# Altium schematic sheet 5_Analog.SchDoc
size A3; DocumentNumber: 6; SheetNumber: 6; SheetTotal: 6
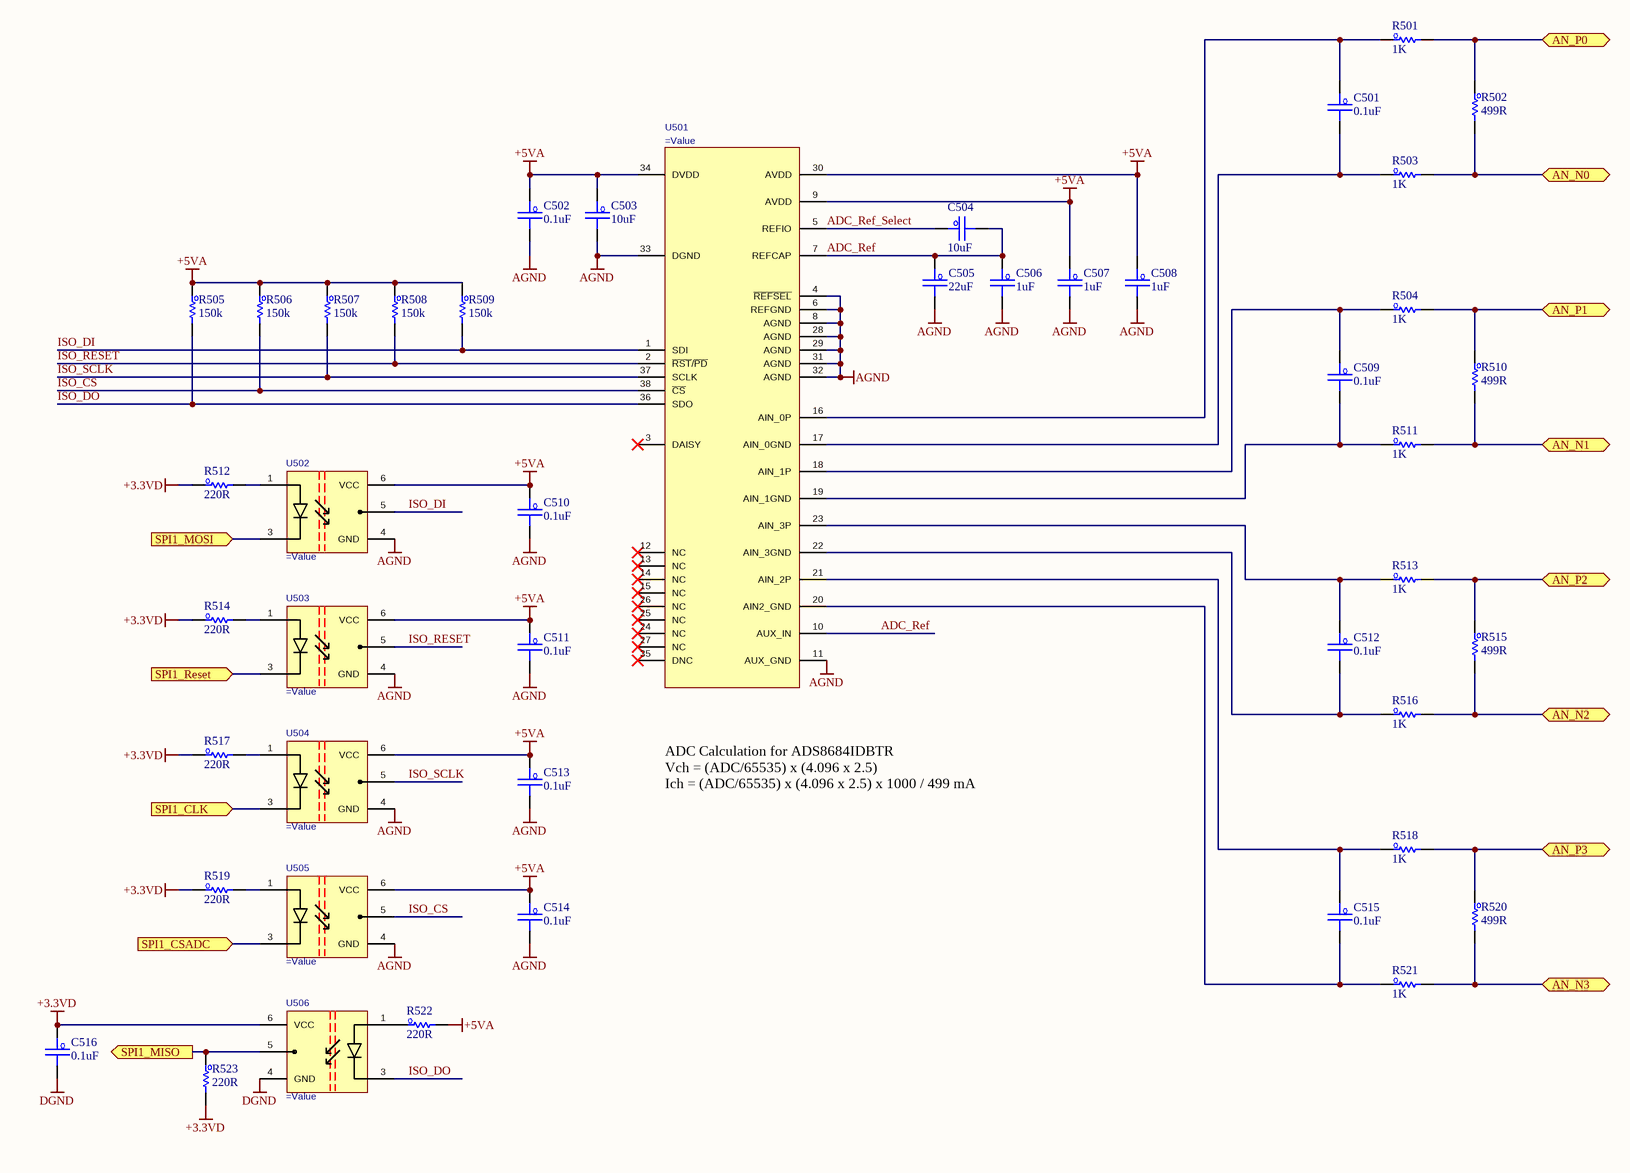
[diagram p0: 5_Analog.SchDoc]

## Parts
C501  0.1uF  [C_0603]
C502  0.1uF  [C_0603]
C503  10uF  [C_0603]
C504  10uF  [C_0603]
C505  22uF  [C_0603]
C506  1uF  [C_0603]
C507  1uF  [C_0603]
C508  1uF  [C_0603]
C509  0.1uF  [C_0603]
C510  0.1uF  [C_0603]
C511  0.1uF  [C_0603]
C512  0.1uF  [C_0603]
C513  0.1uF  [C_0603]
C514  0.1uF  [C_0603]
C515  0.1uF  [C_0603]
C516  0.1uF  [C_0603]
R501  1K  [R_0603]
R502  499R  [R_0603]
R503  1K  [R_0603]
R504  1K  [R_0603]
R505  150k  [R_0603]
R506  150k  [R_0603]
R507  150k  [R_0603]
R508  150k  [R_0603]
R509  150k  [R_0603]
R510  499R  [R_0603]
R511  1K  [R_0603]
R512  220R  [R_0603]
R513  1K  [R_0603]
R514  220R  [R_0603]
R515  499R  [R_0603]
R516  1K  [R_0603]
R517  220R  [R_0603]
R518  1K  [R_0603]
R519  220R  [R_0603]
R520  499R  [R_0603]
R521  1K  [R_0603]
R522  220R  [R_0603]
R523  220R  [R_0603]
U501  (no value)  [DBT0038A_N_TEX]
U502  (no value)  [5PIN SO6_TOS]
U503  (no value)  [5PIN SO6_TOS]
U504  (no value)  [5PIN SO6_TOS]
U505  (no value)  [5PIN SO6_TOS]
U506  (no value)  [5PIN SO6_TOS]

## Ports
AN_N0 (bidir), AN_N1 (bidir), AN_N2 (bidir), AN_N3 (bidir), AN_P0 (bidir), AN_P1 (bidir), AN_P2 (bidir), AN_P3 (bidir), SPI1_CLK (in), SPI1_CSADC (in), SPI1_MISO (out), SPI1_MOSI (in), SPI1_Reset (in)

## Nets
+3.3VD: C516.1 R512.1 R514.1 R517.1 R519.1 R523.2 U506.6(VCC)
+5VA: C502.1 C503.1 C507.1 C508.1 C510.1 C511.1 C513.1 C514.1 R505.1 R506.1 R507.1 R508.1 R509.1 R522.2 U501.9(AVDD) U501.30(AVDD) U501.34(DVDD) U502.6(VCC) U503.6(VCC) U504.6(VCC) U505.6(VCC)
AGND: C502.2 C503.2 C505.2 C506.2 C507.2 C508.2 C510.2 C511.2 C513.2 C514.2 U501.4(~{REFSEL}) U501.6(REFGND) U501.8(AGND) U501.11(AUX_GND) U501.28(AGND) U501.29(AGND) U501.31(AGND) U501.32(AGND) U501.33(DGND) U502.4(GND) U503.4(GND) U504.4(GND) U505.4(GND)
DGND: C516.2 U506.4(GND)
ADC_Ref: C504.2 C505.1 C506.1 U501.7(REFCAP) U501.10(AUX_IN)
ADC_Ref_Select: C504.1 U501.5(REFIO)
AN_N0: R502.2 R503.2 ; port AN_N0
AN_N1: R510.2 R511.2 ; port AN_N1
AN_N2: R515.2 R516.2 ; port AN_N2
AN_N3: R520.2 R521.2 ; port AN_N3
AN_P0: R501.2 R502.1 ; port AN_P0
AN_P1: R504.2 R510.1 ; port AN_P1
AN_P2: R513.2 R515.1 ; port AN_P2
AN_P3: R518.2 R520.1 ; port AN_P3
ISO_CS: R506.2 U501.38(~{CS}) U505.5(O1)
ISO_DI: R509.2 U501.1(SDI) U502.5(O1)
ISO_DO: R505.2 U501.36(SDO) U506.3(A)
ISO_RESET: R508.2 U501.2(~{RST}/~{PD}) U503.5(O1)
ISO_SCLK: R507.2 U501.37(SCLK) U504.5(O1)
SPI1_CLK: U504.3(A) ; port SPI1_CLK
SPI1_CSADC: U505.3(A) ; port SPI1_CSADC
SPI1_MISO: R523.1 U506.5(O1) ; port SPI1_MISO
SPI1_MOSI: U502.3(A) ; port SPI1_MOSI
SPI1_Reset: U503.3(A) ; port SPI1_Reset
NetC501_1: C501.1 R501.1 U501.16(AIN_0P)
NetC501_2: C501.2 R503.1 U501.17(AIN_0GND)
NetC509_1: C509.1 R504.1 U501.18(AIN_1P)
NetC509_2: C509.2 R511.1 U501.19(AIN_1GND)
NetC512_1: C512.1 R513.1 U501.23(AIN_3P)
NetC512_2: C512.2 R516.1 U501.22(AIN_3GND)
NetC515_1: C515.1 R518.1 U501.21(AIN_2P)
NetC515_2: C515.2 R521.1 U501.20(AIN2_GND)
NetR512_2: R512.2 U502.1(A)
NetR514_2: R514.2 U503.1(A)
NetR517_2: R517.2 U504.1(A)
NetR519_2: R519.2 U505.1(A)
NetR522_1: R522.1 U506.1(A)

Not connected (* = marked no-connect by the designer): U501 3(DAISY)* 12(NC)* 13(NC)* 14(NC)* 15(NC)* 24(NC)* 25(NC)* 26(NC)* 27(NC)* 35(DNC)*

## Notes on the sheet
- ADC Calculation for ADS8684IDBTR
  Vch = (ADC/65535) x (4.096 x 2.5)
  Ich = (ADC/65535) x (4.096 x 2.5) x 1000 / 499 mA
- Title :
- Revision :
- ผู้จัดทำ:
- Size:
- A3
- Time:
- ผู้เขียน:
- บริษัท ยูนิเวอร์แซล ยูทีลิตี้ส์ จำกัด (มหาชน) เลขที่ 1 อาคาร อีสท์วอเตอร์ ชั้น 18 ซอยวิภาวดีรังสิต 5 แขวงจอมพล เขตจตุจักร กรุงเทพฯ 10900
  Tel : +662-272-1688
  Fax :+662-2721690-1
- -
- Sheet:
- of
- ผู้อำนวยการ
- ผู้ตรวจสอบ:
- Number:
- กรรมการผู้จัดการ:
- File:

## Library data of the parts
C501 C502 C509-C516 = C_Capacitor: CAP CER 0.1UF 50V X7R 0603; Manufacturer: KEMET; PartNumber: C0603C104K5RACTU; PackageReference: 0603; PartID: 399-5089-1-ND; Value2: 50V; Value: 0.1uF; Value3: *
C503 C504 = C_Capacitor: CAP CER 10UF 10V X6S 0603; Manufacturer: Murata Electronics; PartNumber: GRT188C81A106ME13D; PackageReference: 0603; PartID: 490-12283-1-ND; Value2: 10V; Value: 10uF; Value3: *
C505 = C_Capacitor: CAP CER 22UF 10V X5R 0603; Manufacturer: Murata Electronics; PartNumber: GRM187R61A226ME15D; PackageReference: 0603; PartID: 490-13243-1-ND; Value2: 10V; Value: 22uF; Value3: *
C506-C508 = C_Capacitor: CAP CER 1UF 50V X5R 0603; Manufacturer: Murata Electronics; PartNumber: GRT188R61H105KE13D; PackageReference: 0603; PartID: 490-12330-1-ND; Value2: 50V; Value: 1uF; Value3: *
R501 R503 R504 R511 R513 R516 R518 R521 = R_Resister: RES SMD 1K OHM 5% 1/10W 0603; Manufacturer: Vishay Dale; PartNumber: CRCW06031K00JNEA; Value2: 0.1W; Value: 1K; PackageReference: 0603; PartID: 541-1.0KGCT-ND; Value3: *
R502 R510 R515 R520 = R_Resister: RES SMD 499 OHM 1% 1/3W 0603; Manufacturer: Vishay Dale; PartNumber: CRCW0603499RFKEAHP; Value2: 0.333W; Value: 499R; PackageReference: 0603; PartID: 541-499SCT-ND; Value3: *
R505-R509 = R_Resister: RES SMD 150K OHM 1% 1/10W 0603; Manufacturer: Vishay Dale; PartNumber: CRCW0603150KFKEAC; Value2: 0.1W; Value: 150k; PackageReference: 0603; PartID: 541-4034-1-ND; Value3: *
R512 R514 R517 R519 R522 R523 = R_Resister: RES SMD 220 OHM 1% 1/10W 0603; Manufacturer: Vishay Dale; PartNumber: CRCW0603220RFKEAC; Value2: 0.1W; Value: 220R; PackageReference: 0603; PartID: 541-4047-1-ND; Value3: *
U501 = IC_ADC_ADS8684IDBTR: IC ADC 16BIT SAR 38TSSOP; Manufacturer: Texas Instruments; Value3: TIPD166; Value: ADS8684IDBTR; PackageReference: 38-TSSOP; PartID: 296-39875-1-ND; PartNumber: ADS8684IDBTR
U502-U506 = IC_OPTO_TLP109(TPR,E): OPTOISO 5KV PUSH PULL SO6L; Manufacturer: Toshiba Semiconductor and Storage; Value2: FODM453R2V; Value: TLP109(TPR,E); PackageReference: SO-6; PartID: TLP109(TPRE)CT-ND; PartNumber: TLP109(TPR,E)